# Altium schematic sheet SDIO_SPDT_TX02612.SchDoc
size A3; SheetNumber: 17; SheetTotal: 27
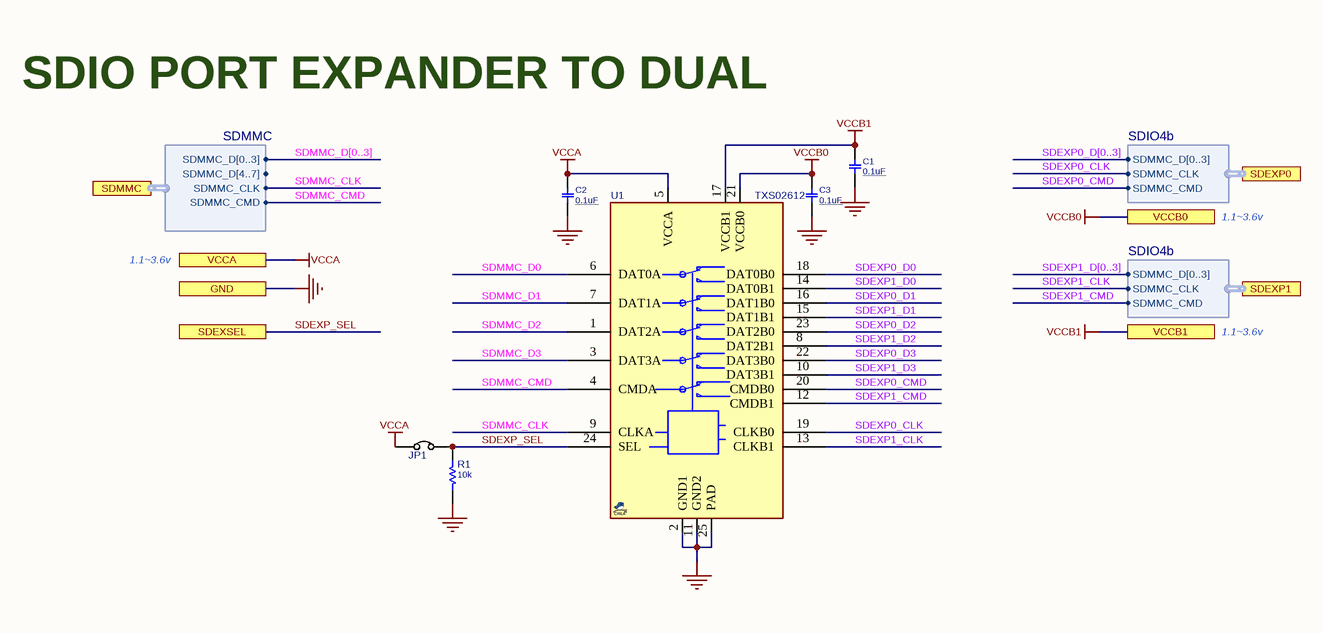
[diagram p0: SDIO_SPDT_TX02612.SchDoc]

## Parts
C1  0.1uF  [C0402]
C2  0.1uF  [C0402]
C3  0.1uF  [C0402]
JP1  JMPSOLDER  [JP_60X100]  (value not drawn)
R1  10k  [R0402]
U1  TXS02612  [QFN50_24T]

## Ports
GND, SDEXP0 (harness SDIO4b), SDEXP1 (harness SDIO4b), SDEXSEL, SDMMC (harness SDMMC), VCCA, VCCB0, VCCB1

## Harnesses
SDMMC: SDMMC_D[0..3], SDMMC_D[4..7], SDMMC_CLK, SDMMC_CMD
SDIO4b: SDMMC_D[0..3], SDMMC_CLK, SDMMC_CMD

## Nets
GND: C1.2 C2.2 C3.2 R1.2 U1.2(GND1) U1.11(GND2) U1.25(PAD) ; port GND
VCCA: C2.1 JP1.2 U1.5(VCCA) ; port VCCA
VCCB0: C3.1 U1.21(VCCB0) ; port VCCB0
VCCB1: C1.1 U1.17(VCCB1) ; port VCCB1
SDEXP0_CLK: U1.19(CLKB0) ; port SDEXP0.SDMMC_CLK
SDEXP0_CMD: U1.20(CMDB0) ; port SDEXP0.SDMMC_CMD
SDEXP0_D0: U1.18(DAT0B0)
SDEXP0_D1: U1.16(DAT1B0)
SDEXP0_D2: U1.23(DAT2B0)
SDEXP0_D3: U1.22(DAT3B0)
SDEXP1_CLK: U1.13(CLKB1) ; port SDEXP1.SDMMC_CLK
SDEXP1_CMD: U1.12(CMDB1) ; port SDEXP1.SDMMC_CMD
SDEXP1_D0: U1.14(DAT0B1)
SDEXP1_D1: U1.15(DAT1B1)
SDEXP1_D2: U1.8(DAT2B1)
SDEXP1_D3: U1.10(DAT3B1)
SDEXP_SEL: JP1.1 R1.1 U1.24(SEL) ; port SDEXSEL
SDMMC_CLK: U1.9(CLKA) ; port SDMMC.SDMMC_CLK
SDMMC_CMD: U1.4(CMDA) ; port SDMMC.SDMMC_CMD
SDMMC_D0: U1.6(DAT0A)
SDMMC_D1: U1.7(DAT1A)
SDMMC_D2: U1.1(DAT2A)
SDMMC_D3: U1.3(DAT3A)

## Buses and harness runs
bus SDEXP0_D[0..3]
bus SDEXP1_D[0..3]
bus SDMMC_D[0..3]

## Notes on the sheet
- SDIO PORT EXPANDER TO DUAL
- 1.1~3.6v

## Library data of the parts
C1-C3 = CAP_SMD_MLCC: CAP, MLCC; DESC: CAP, MLCC, 1nF, 50V, C0G, 10%, 0402; MANF_P#: MANF_PART#; MANF: Murata; PARAM2: 50V; PARAM: -; PRICE: 100= 1$; ASSEMBLY: ASSEMBLY; VALUE: 0.1uF
JP1 = JUMPER_SOLDER: JUMPER, HEADER 2PIN; MANF: MANF; MANF_P#: MANF_P#; VALUE: JMPSOLDER
R1 = RES_SMD: RESISTOR, SMD; PARAM: 0.063W; DESC: DESCRIPTION; DIST#: MOUSER; PARAM2: 1%; MANF_P#: -; MANF: -; ASSEMBLY: ASSEMBLY; PRICE: 100= 0.3$; VALUE: 10k
U1 = TXS02612_QFN24: I/O Expander, SDIO; MANF: Texas Instruments; MANF_P#: TXS02612RTWR; PARAM2: 1.1~3.6V; VALUE: TXS02612